# EAGLE design LED_board (EAGLE 9.6.2)
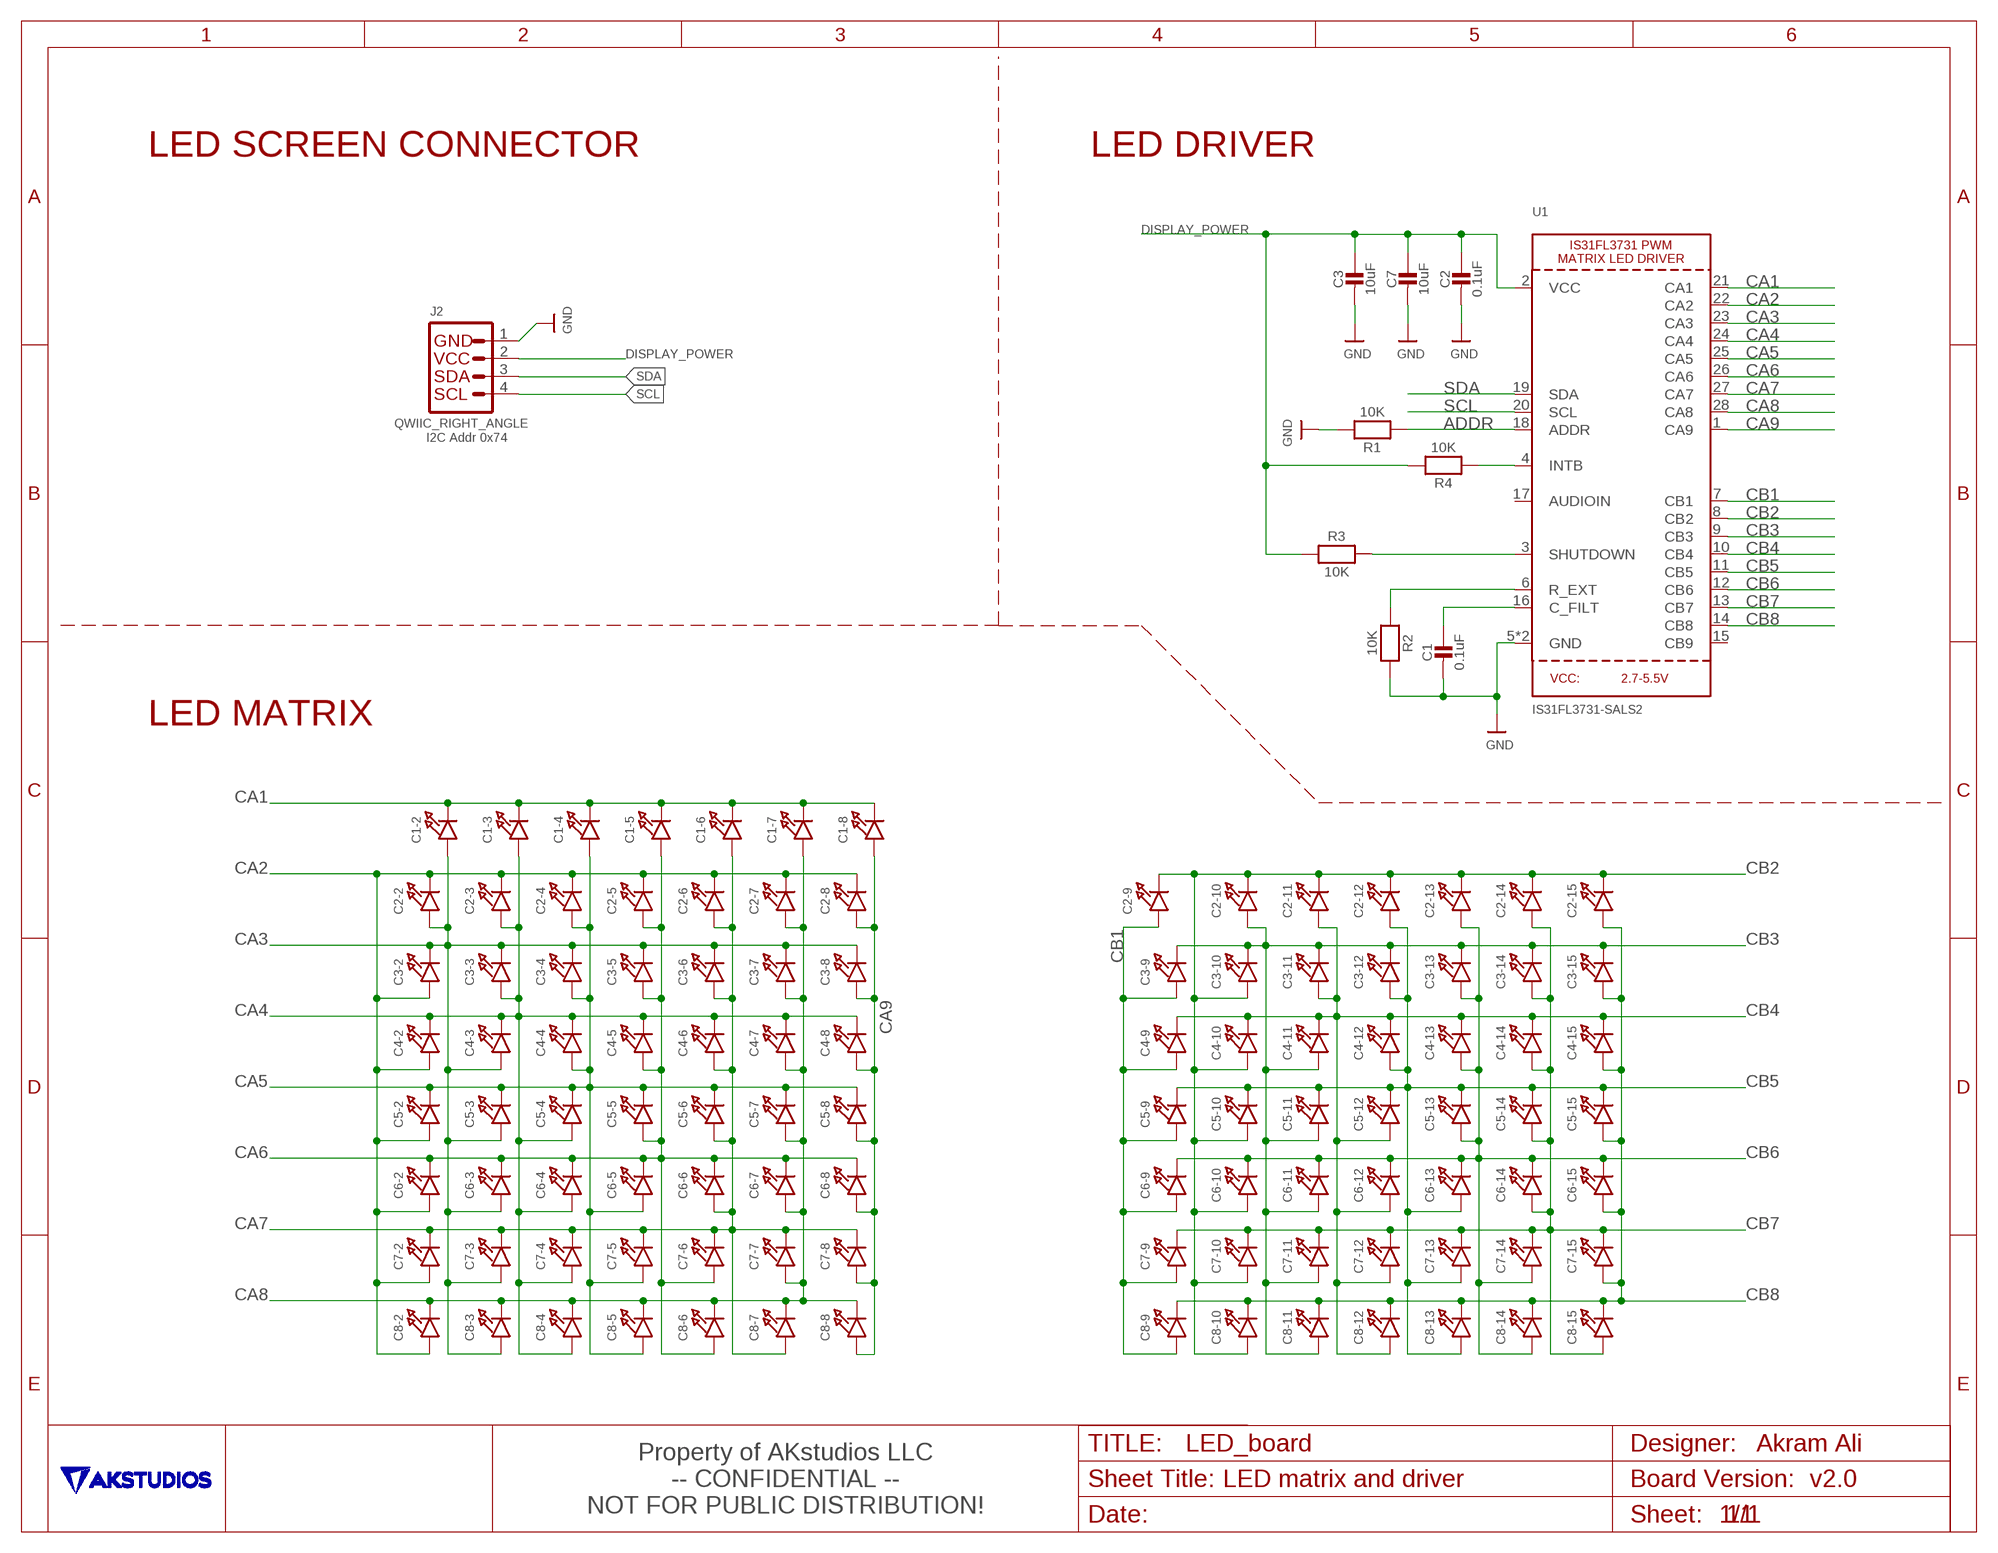
[diagram p0: schematic, sheet 1]

## Parts
C1  0.1uF  MICROBUILDER_CAP_CERAMIC_0402MP  [MICROBUILDER__0402MP]
C1-2  LED0603_NOOUTLINE  [CHIPLED_0603_NOOUTLINE]
C1-3  LED0603_NOOUTLINE  [CHIPLED_0603_NOOUTLINE]
C1-4  LED0603_NOOUTLINE  [CHIPLED_0603_NOOUTLINE]
C1-5  LED0603_NOOUTLINE  [CHIPLED_0603_NOOUTLINE]
C1-6  LED0603_NOOUTLINE  [CHIPLED_0603_NOOUTLINE]
C1-7  LED0603_NOOUTLINE  [CHIPLED_0603_NOOUTLINE]
C1-8  LED0603_NOOUTLINE  [CHIPLED_0603_NOOUTLINE]
C2  0.1uF  MICROBUILDER_CAP_CERAMIC_0402MP  [MICROBUILDER__0402MP]
C2-2  LED0603_NOOUTLINE  [CHIPLED_0603_NOOUTLINE]
C2-3  LED0603_NOOUTLINE  [CHIPLED_0603_NOOUTLINE]
C2-4  LED0603_NOOUTLINE  [CHIPLED_0603_NOOUTLINE]
C2-5  LED0603_NOOUTLINE  [CHIPLED_0603_NOOUTLINE]
C2-6  LED0603_NOOUTLINE  [CHIPLED_0603_NOOUTLINE]
C2-7  LED0603_NOOUTLINE  [CHIPLED_0603_NOOUTLINE]
C2-8  LED0603_NOOUTLINE  [CHIPLED_0603_NOOUTLINE]
C2-9  LED0603_NOOUTLINE  [CHIPLED_0603_NOOUTLINE]
C2-10  LED0603_NOOUTLINE  [CHIPLED_0603_NOOUTLINE]
C2-11  LED0603_NOOUTLINE  [CHIPLED_0603_NOOUTLINE]
C2-12  LED0603_NOOUTLINE  [CHIPLED_0603_NOOUTLINE]
C2-13  LED0603_NOOUTLINE  [CHIPLED_0603_NOOUTLINE]
C2-14  LED0603_NOOUTLINE  [CHIPLED_0603_NOOUTLINE]
C2-15  LED0603_NOOUTLINE  [CHIPLED_0603_NOOUTLINE]
C3  10uF  MICROBUILDER_CAP_CERAMIC_0402MP  [MICROBUILDER__0402MP]
C3-2  LED0603_NOOUTLINE  [CHIPLED_0603_NOOUTLINE]
C3-3  LED0603_NOOUTLINE  [CHIPLED_0603_NOOUTLINE]
C3-4  LED0603_NOOUTLINE  [CHIPLED_0603_NOOUTLINE]
C3-5  LED0603_NOOUTLINE  [CHIPLED_0603_NOOUTLINE]
C3-6  LED0603_NOOUTLINE  [CHIPLED_0603_NOOUTLINE]
C3-7  LED0603_NOOUTLINE  [CHIPLED_0603_NOOUTLINE]
C3-8  LED0603_NOOUTLINE  [CHIPLED_0603_NOOUTLINE]
C3-9  LED0603_NOOUTLINE  [CHIPLED_0603_NOOUTLINE]
C3-10  LED0603_NOOUTLINE  [CHIPLED_0603_NOOUTLINE]
C3-11  LED0603_NOOUTLINE  [CHIPLED_0603_NOOUTLINE]
C3-12  LED0603_NOOUTLINE  [CHIPLED_0603_NOOUTLINE]
C3-13  LED0603_NOOUTLINE  [CHIPLED_0603_NOOUTLINE]
C3-14  LED0603_NOOUTLINE  [CHIPLED_0603_NOOUTLINE]
C3-15  LED0603_NOOUTLINE  [CHIPLED_0603_NOOUTLINE]
C4-2  LED0603_NOOUTLINE  [CHIPLED_0603_NOOUTLINE]
C4-3  LED0603_NOOUTLINE  [CHIPLED_0603_NOOUTLINE]
C4-4  LED0603_NOOUTLINE  [CHIPLED_0603_NOOUTLINE]
C4-5  LED0603_NOOUTLINE  [CHIPLED_0603_NOOUTLINE]
C4-6  LED0603_NOOUTLINE  [CHIPLED_0603_NOOUTLINE]
C4-7  LED0603_NOOUTLINE  [CHIPLED_0603_NOOUTLINE]
C4-8  LED0603_NOOUTLINE  [CHIPLED_0603_NOOUTLINE]
C4-9  LED0603_NOOUTLINE  [CHIPLED_0603_NOOUTLINE]
C4-10  LED0603_NOOUTLINE  [CHIPLED_0603_NOOUTLINE]
C4-11  LED0603_NOOUTLINE  [CHIPLED_0603_NOOUTLINE]
C4-12  LED0603_NOOUTLINE  [CHIPLED_0603_NOOUTLINE]
C4-13  LED0603_NOOUTLINE  [CHIPLED_0603_NOOUTLINE]
C4-14  LED0603_NOOUTLINE  [CHIPLED_0603_NOOUTLINE]
C4-15  LED0603_NOOUTLINE  [CHIPLED_0603_NOOUTLINE]
C5-2  LED0603_NOOUTLINE  [CHIPLED_0603_NOOUTLINE]
C5-3  LED0603_NOOUTLINE  [CHIPLED_0603_NOOUTLINE]
C5-4  LED0603_NOOUTLINE  [CHIPLED_0603_NOOUTLINE]
C5-5  LED0603_NOOUTLINE  [CHIPLED_0603_NOOUTLINE]
C5-6  LED0603_NOOUTLINE  [CHIPLED_0603_NOOUTLINE]
C5-7  LED0603_NOOUTLINE  [CHIPLED_0603_NOOUTLINE]
C5-8  LED0603_NOOUTLINE  [CHIPLED_0603_NOOUTLINE]
C5-9  LED0603_NOOUTLINE  [CHIPLED_0603_NOOUTLINE]
C5-10  LED0603_NOOUTLINE  [CHIPLED_0603_NOOUTLINE]
C5-11  LED0603_NOOUTLINE  [CHIPLED_0603_NOOUTLINE]
C5-12  LED0603_NOOUTLINE  [CHIPLED_0603_NOOUTLINE]
C5-13  LED0603_NOOUTLINE  [CHIPLED_0603_NOOUTLINE]
C5-14  LED0603_NOOUTLINE  [CHIPLED_0603_NOOUTLINE]
C5-15  LED0603_NOOUTLINE  [CHIPLED_0603_NOOUTLINE]
C6-2  LED0603_NOOUTLINE  [CHIPLED_0603_NOOUTLINE]
C6-3  LED0603_NOOUTLINE  [CHIPLED_0603_NOOUTLINE]
C6-4  LED0603_NOOUTLINE  [CHIPLED_0603_NOOUTLINE]
C6-5  LED0603_NOOUTLINE  [CHIPLED_0603_NOOUTLINE]
C6-6  LED0603_NOOUTLINE  [CHIPLED_0603_NOOUTLINE]
C6-7  LED0603_NOOUTLINE  [CHIPLED_0603_NOOUTLINE]
C6-8  LED0603_NOOUTLINE  [CHIPLED_0603_NOOUTLINE]
C6-9  LED0603_NOOUTLINE  [CHIPLED_0603_NOOUTLINE]
C6-10  LED0603_NOOUTLINE  [CHIPLED_0603_NOOUTLINE]
C6-11  LED0603_NOOUTLINE  [CHIPLED_0603_NOOUTLINE]
C6-12  LED0603_NOOUTLINE  [CHIPLED_0603_NOOUTLINE]
C6-13  LED0603_NOOUTLINE  [CHIPLED_0603_NOOUTLINE]
C6-14  LED0603_NOOUTLINE  [CHIPLED_0603_NOOUTLINE]
C6-15  LED0603_NOOUTLINE  [CHIPLED_0603_NOOUTLINE]
C7  10uF  MICROBUILDER_CAP_CERAMIC_0402MP  [MICROBUILDER__0402MP]
C7-2  LED0603_NOOUTLINE  [CHIPLED_0603_NOOUTLINE]
C7-3  LED0603_NOOUTLINE  [CHIPLED_0603_NOOUTLINE]
C7-4  LED0603_NOOUTLINE  [CHIPLED_0603_NOOUTLINE]
C7-5  LED0603_NOOUTLINE  [CHIPLED_0603_NOOUTLINE]
C7-6  LED0603_NOOUTLINE  [CHIPLED_0603_NOOUTLINE]
C7-7  LED0603_NOOUTLINE  [CHIPLED_0603_NOOUTLINE]
C7-8  LED0603_NOOUTLINE  [CHIPLED_0603_NOOUTLINE]
C7-9  LED0603_NOOUTLINE  [CHIPLED_0603_NOOUTLINE]
C7-10  LED0603_NOOUTLINE  [CHIPLED_0603_NOOUTLINE]
C7-11  LED0603_NOOUTLINE  [CHIPLED_0603_NOOUTLINE]
C7-12  LED0603_NOOUTLINE  [CHIPLED_0603_NOOUTLINE]
C7-13  LED0603_NOOUTLINE  [CHIPLED_0603_NOOUTLINE]
C7-14  LED0603_NOOUTLINE  [CHIPLED_0603_NOOUTLINE]
C7-15  LED0603_NOOUTLINE  [CHIPLED_0603_NOOUTLINE]
C8-2  LED0603_NOOUTLINE  [CHIPLED_0603_NOOUTLINE]
C8-3  LED0603_NOOUTLINE  [CHIPLED_0603_NOOUTLINE]
C8-4  LED0603_NOOUTLINE  [CHIPLED_0603_NOOUTLINE]
C8-5  LED0603_NOOUTLINE  [CHIPLED_0603_NOOUTLINE]
C8-6  LED0603_NOOUTLINE  [CHIPLED_0603_NOOUTLINE]
C8-7  LED0603_NOOUTLINE  [CHIPLED_0603_NOOUTLINE]
C8-8  LED0603_NOOUTLINE  [CHIPLED_0603_NOOUTLINE]
C8-9  LED0603_NOOUTLINE  [CHIPLED_0603_NOOUTLINE]
C8-10  LED0603_NOOUTLINE  [CHIPLED_0603_NOOUTLINE]
C8-11  LED0603_NOOUTLINE  [CHIPLED_0603_NOOUTLINE]
C8-12  LED0603_NOOUTLINE  [CHIPLED_0603_NOOUTLINE]
C8-13  LED0603_NOOUTLINE  [CHIPLED_0603_NOOUTLINE]
C8-14  LED0603_NOOUTLINE  [CHIPLED_0603_NOOUTLINE]
C8-15  LED0603_NOOUTLINE  [CHIPLED_0603_NOOUTLINE]
J2  QWIIC_RIGHT_ANGLE  QWIIC_CONNECTORJS-1MM  [JST04_1MM_RA]
R1  10K  MICROBUILDER_RESISTOR_0402MP  [MICROBUILDER__0402MP]
R2  10K  MICROBUILDER_RESISTOR_0402MP  [MICROBUILDER__0402MP]
R3  10K  MICROBUILDER_RESISTOR_0402MP  [MICROBUILDER__0402MP]
R4  10K  MICROBUILDER_RESISTOR_0402MP  [MICROBUILDER__0402MP]
U1  IS31FL3731-SALS2  IS31FL3731QFN  [QFN28_4MM_0.4MM]

## Nets
ADDR: R1.1 U1.18(ADDR)
CA1: C1-2.C C1-3.C C1-4.C C1-5.C C1-6.C C1-7.C C1-8.C U1.21(CA1)
CA2: C2-2.C C2-3.C C2-4.C C2-5.C C2-6.C C2-7.C C2-8.C C3-2.A C4-2.A C5-2.A C6-2.A C7-2.A C8-2.A U1.22(CA2)
CA3: C1-2.A C2-2.A C3-2.C C3-3.C C3-4.C C3-5.C C3-6.C C3-7.C C3-8.C C4-3.A C5-3.A C6-3.A C7-3.A C8-3.A U1.23(CA3)
CA4: C1-3.A C2-3.A C3-3.A C4-2.C C4-3.C C4-4.C C4-5.C C4-6.C C4-7.C C4-8.C C5-4.A C6-4.A C7-4.A C8-4.A U1.24(CA4)
CA5: C1-4.A C2-4.A C3-4.A C4-4.A C5-2.C C5-3.C C5-4.C C5-5.C C5-6.C C5-7.C C5-8.C C6-5.A C7-5.A C8-5.A U1.25(CA5)
CA6: C1-5.A C2-5.A C3-5.A C4-5.A C5-5.A C6-2.C C6-3.C C6-4.C C6-5.C C6-6.C C6-7.C C6-8.C C7-6.A C8-6.A U1.26(CA6)
CA7: C1-6.A C2-6.A C3-6.A C4-6.A C5-6.A C6-6.A C7-2.C C7-3.C C7-4.C C7-5.C C7-6.C C7-7.C C7-8.C C8-7.A U1.27(CA7)
CA8: C1-7.A C2-7.A C3-7.A C4-7.A C5-7.A C6-7.A C7-7.A C8-2.C C8-3.C C8-4.C C8-5.C C8-6.C C8-7.C C8-8.C U1.28(CA8)
CA9: C1-8.A C2-8.A C3-8.A C4-8.A C5-8.A C6-8.A C7-8.A C8-8.A U1.1(CA9)
CB1: C2-9.A C3-9.A C4-9.A C5-9.A C6-9.A C7-9.A C8-9.A U1.7(CB1)
CB2: C2-9.C C2-10.C C2-11.C C2-12.C C2-13.C C2-14.C C2-15.C C3-10.A C4-10.A C5-10.A C6-10.A C7-10.A C8-10.A U1.8(CB2)
CB3: C2-10.A C3-9.C C3-10.C C3-11.C C3-12.C C3-13.C C3-14.C C3-15.C C4-11.A C5-11.A C6-11.A C7-11.A C8-11.A U1.9(CB3)
CB4: C2-11.A C3-11.A C4-9.C C4-10.C C4-11.C C4-12.C C4-13.C C4-14.C C4-15.C C5-12.A C6-12.A C7-12.A C8-12.A U1.10(CB4)
CB5: C2-12.A C3-12.A C4-12.A C5-9.C C5-10.C C5-11.C C5-12.C C5-13.C C5-14.C C5-15.C C6-13.A C7-13.A C8-13.A U1.11(CB5)
CB6: C2-13.A C3-13.A C4-13.A C5-13.A C6-9.C C6-10.C C6-11.C C6-12.C C6-13.C C6-14.C C6-15.C C7-14.A C8-14.A U1.12(CB6)
CB7: C2-14.A C3-14.A C4-14.A C5-14.A C6-14.A C7-9.C C7-10.C C7-11.C C7-12.C C7-13.C C7-14.C C7-15.C C8-15.A U1.13(CB7)
CB8: C2-15.A C3-15.A C4-15.A C5-15.A C6-15.A C7-15.A C8-9.C C8-10.C C8-11.C C8-12.C C8-13.C C8-14.C C8-15.C U1.14(CB8)
DISPLAY_POWER: C2.1 C3.1 C7.1 J2.2 R3.1 R4.2 U1.2(VCC)
GND: C1.2 C2.2 C3.2 C7.2 J2.1 R1.2 R2.2 U1.5(GND) U1.THERMAL(GND)
N$1: R3.2 U1.3(SHUTDOWN)
N$2: C1.1 U1.16(C_FILT)
N$3: R4.1 U1.4(INTB)
R_EXT: R2.1 U1.6(R_EXT)
SCL: J2.4 U1.20(SCL)
SDA: J2.3 U1.19(SDA)
Unconnected: U1.15(CB9) U1.17(AUDIOIN)

## Notes on the sheet
- LED SCREEN CONNECTOR | LED DRIVER
- I2C Addr 0x74
- LED MATRIX
- Akram Ali
- Property of AKstudios LLC
- v2.0
- -- CONFIDENTIAL --
  NOT FOR PUBLIC DISTRIBUTION!

## Library data of the parts
C1-C3 C7 = Adafruit Feather 32u4 Bluefruit LE:MICROBUILDER_CAP_CERAMIC: Ceramic Capacitors For new designs, use the packages preceded by an '_' character since they are more reliable: The following footprints should be used on most boards: _0402 - Standard footprint for regular board layouts _0603 - Standard footprint for regular board layouts _0805 - Standard footprint for regular board layouts _1206 - Standard footprint for regular board layouts For extremely tight-pitch boards where space is at a premium, the following 'micro-pitch' footprints can be used (smaller pads, no silkscreen outline, etc.): _0402MP - Micro-pitch footprint for very dense/compact boards _0603MP - Micro-pitch footprint for very dense/compact boards _0805MP - Micro-pitch footprint for very dense/compact boards _1206MP - Micro-pitch footprint for very dense/compact boards; MPN: GRM155R71C104KA88J
C1-2-C1-8 C2-2-C2-15 C3-2-C3-15 C4-2-C4-15 C5-2-C5-15 C6-2-C6-15 C7-2-C7-15 C8-2-C8-15 = microbuilder:LED: LED 0603 - 0603 Surface Mount Package 2mA: Green LED - Low Power (3.9mcd, 2ma, 1.7Vf) - Digikey: 475-2709-2-ND Orange LED - Low Power (9.8mcd, 2ma, 1.8Vf) - Digikey: 475-1194-2-ND Red LED - Low Power (5mcd, 2ma, 1.8Vf) - Digikey: 475-1195-2-ND Yellow LED - Low Power (7mcd, 2ma, 1.8Vf) - Digikey: 475-1196-2-ND 5mA: Blue LED - Low Power (17mcd, 5ma, 2.9Vf) - Digikey: LNJ937W8CRACT-ND 0805 - 0805 Surface Mount Package 2mA: Red LED (8.8mcd, 2mA, 1.8Vf, Clear) - Low Power [Digikey: 475-2510-1-ND] Green LED (5mcd, 2mA, 1.8Vf, Clear) - Low Power [Digikey: 475-2730-1-ND] Yellow LED (11.3mcd, 2mA, 1.8Vf, Clear) - Low Power [Digikey: 475-2555-1-ND] 20mA: Red LED (104mcd, 20mA, Diffused) - LS R976 [Digikey: 475-1278-6-ND] Red LED (12mcd, 20mA, 2.0Vf, Clear) - APT2012EC [Digikey: 754-1128-1-ND] Green LED (15mcd, 20mA, 2.2Vf, Clear) - APT2012GC [Digikey: 754-1131-1-ND] Orange LED (160mcd, 20mA, 2.1Vf, Clear) - APT2012SECK [Digikey: 754-1130-1-ND] 1206 - 1206 Surface Mount Package Green LED (26mcd, 20mA, Diffused) - LG N971 [Digikey: 475-1407-6-ND] Red LED (15mcd, 20mA, Diffused) - LH N974 [Digikey: 475-1416-6-ND] Cree - Cree High-Power Surface Mount LEDs XPEBWT-L1-0000-00D50 - White 111lm 350mA 2.9Vf 6200K 110° XTEAWT-00-0000-00000LEE3 - White 114lm 350mA 2.85Vf 5000K 115° Everlight - Everlight 45-21 Series Surface Mount LEDs 45-21/QK2C-B2832AC2CB2/2T - Warm White 2000mcd 20mA 3.25Vf 3050K 120° 45-21/LK2C-B38452C4CB2/2T - Nuetral White 2000mcd 20mA 3.25Vf 4150K 120° 45-21/LK2C-B50634C6CB2/2T - Cold White 2200mcd 20mA 3.25Vf 5650K 120° PLCC2 Reverse Mount LS T77K-J1L2-1-0-2-R18-Z - Red 11.25mcd 2mA 1.8Vf 630nm 120° LO T77K-L1M2-24-Z - Orange 19.6mcd 2mA 1.8Vf 606nm 120° LY T77K-K2M1-26-Z - Yellow 15.7mcd 2mA 1.8Vf 587nm 120°
J2 = SparkFun-Connectors:QWIIC_CONNECTOR: SparkFun I2C Standard Qwiic Connector An SMD 1mm pitch JST connector makes it easy and quick (get it? Qwiic?) to connect I2C devices to each other. The Qwiic system <http://www.sparkfun.com/qwiic> enables fast and solderless connection between popular platforms and various sensors and actuators. We carry 200mm <https://www.sparkfun.com/products/14204>, 100mm <https://www.sparkfun.com/products/14205>, 50mm <https://www.sparkfun.com/products/14206>, and breadboard friendly <https://www.sparkfun.com/products/14207> Qwiic cables. We also offer 10 pcs strips <https://www.sparkfun.com/products/14323> the SMD connectors.; MPN: SM04B-SRSS-TB(LF)(SN); PROD_ID: CONN-13694
R1-R4 = Adafruit Feather 32u4 Bluefruit LE:MICROBUILDER_RESISTOR: Resistors For new designs, use the packages preceded by an '_' character since they are more reliable: The following footprints should be used on most boards: _0402 - Standard footprint for regular board layouts _0603 - Standard footprint for regular board layouts _0805 - Standard footprint for regular board layouts _1206 - Standard footprint for regular board layouts For extremely tight-pitch boards where space is at a premium, the following 'micro-pitch' footprints can be used (smaller pads, no silkscreen outline, etc.): _0402MP - Micro-pitch footprint for very dense/compact boards _0603MP - Micro-pitch footprint for very dense/compact boards _0805MP - Micro-pitch footprint for very dense/compact boards _1206MP - Micro-pitch footprint for very dense/compact boards; MPN: RC0402FR-7W10KL
U1 = microbuilder:IS31FL3731: IS31FL3731 PWM LED Matrix Driver

## Net classes
1 power: width 0.127 mm, clearance 0.127 mm

## Board
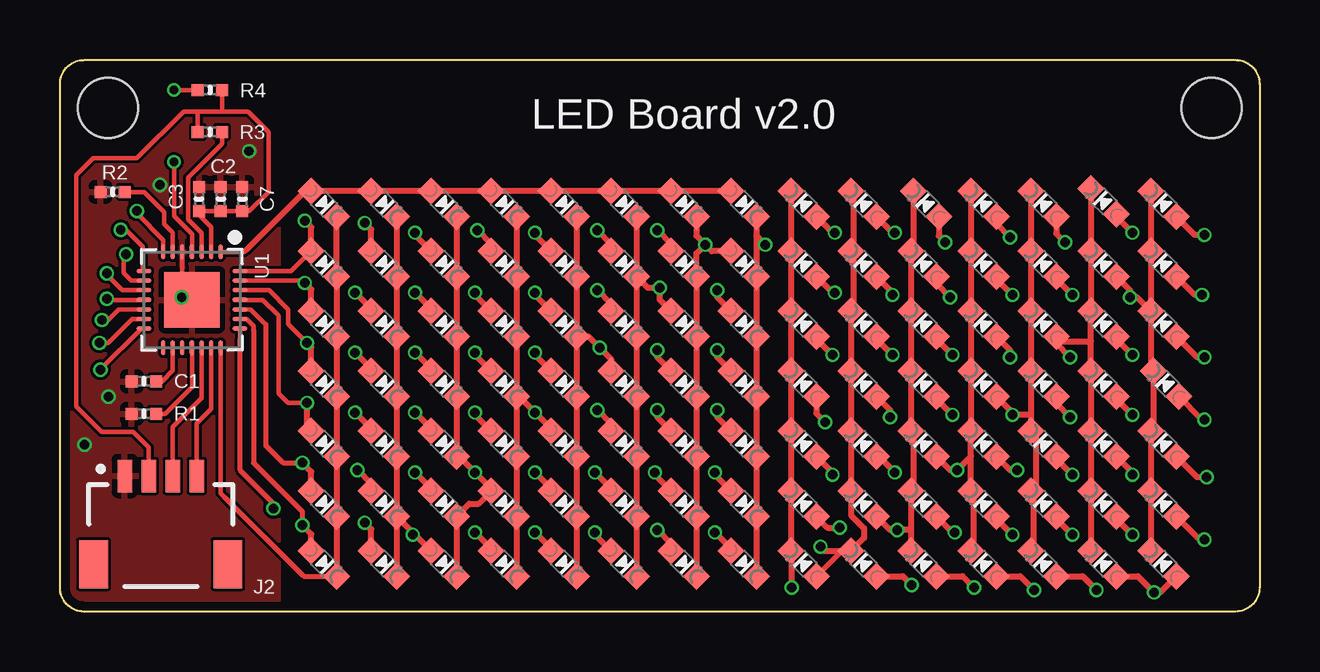
[diagram p1: board, top side]
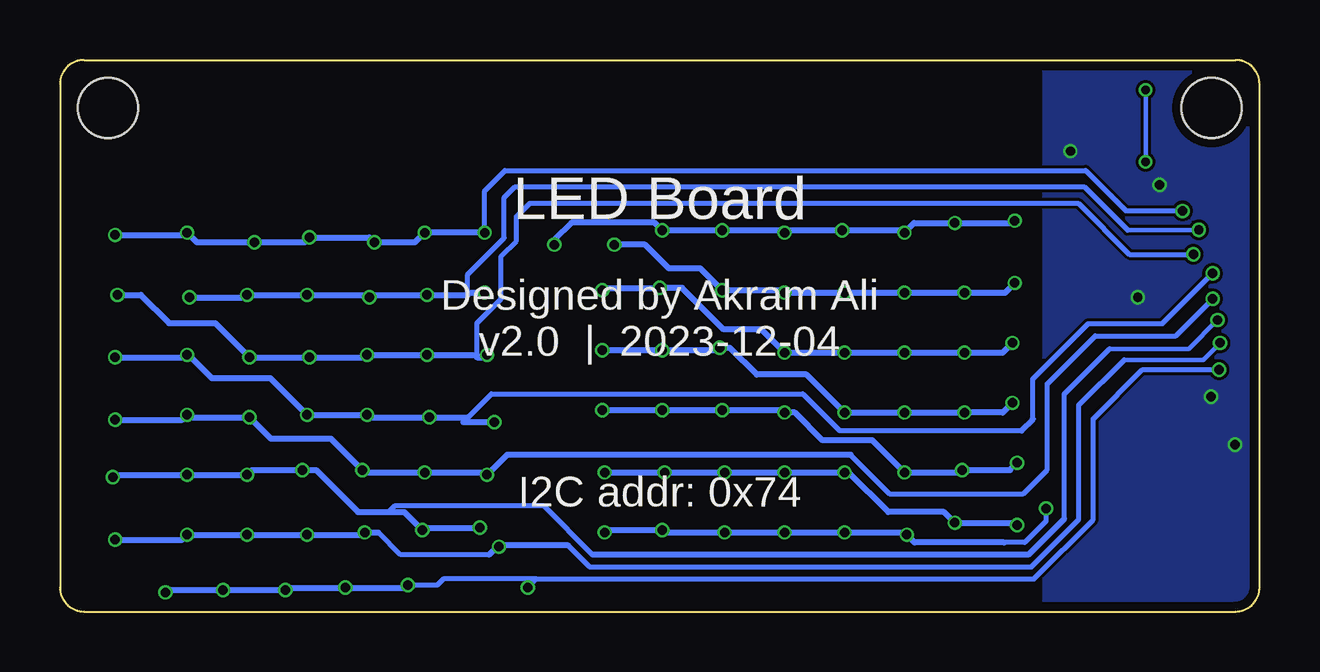
[diagram p2: board, bottom side, seen from below]

Size 50 x 23 mm. Coordinates in mm from the lower left corner, seen from the top.
Outline: 49,0 1,0 arc-90 0,1 0,22 arc-90 1,23 49,23 arc-90 50,22 50,1 arc-90 49,0
Copper layers (1*2*15*16): Top 0.035559375mm / dielectric 0.17018125mm / Route2 0.01778125mm / dielectric 47mil / Route15 0.01778125mm / dielectric 0.17018125mm / Bottom 0.035559375mm
Design rules "oshpark-4layer *": minimum track width 5mil, minimum drill 10mil, track to track 5mil, track to pad 5mil, pad to pad 5mil, via to via 5mil, smd to smd 5mil, copper to edge 15mil, drill to drill 6mil, minimum pad ring 4mil, minimum via ring 4mil, stop-mask expansion 1.5mil, vias tented up to drill 10mil, thermal gap 10mil
Holes 2.5 mm at 2,21 48,21

### Footprints (pad centres in the part's own frame; a part is rotated, then mirrored left to right if it is on the bottom)
MICROBUILDER__0402MP = smd 0.5 x 0.5: 1 -0.508,0; 2 0.508,0
CHIPLED_0603_NOOUTLINE = smd 0.8 x 0.8: A 0,-0.75; C 0,0.75
JST04_1MM_RA = smd 0.6 x 1.35: 1 -1.5,0; 2 -0.5,0; 3 0.5,0; 4 1.5,0 | smd 1.2 x 2: NC1 2.8,-3.675; NC2 -2.8,-3.675
QFN28_4MM_0.4MM = smd 0.6 x 0.18: 1 -2,1.2; 2 -2,0.8; 3 -2,0.4; 4 -2,0; 5 -2,-0.4; 6 -2,-0.8; 7 -2,-1.2; 15 2,-1.2; 16 2,-0.8; 17 2,-0.4; 18 2,0; 19 2,0.4; 20 2,0.8; 21 2,1.2 | smd 0.18 x 0.6: 8 -1.2,-2; 9 -0.8,-2; 10 -0.4,-2; 11 0,-2; 12 0.4,-2; 13 0.8,-2; 14 1.2,-2; 22 1.2,2; 23 0.8,2; 24 0.4,2; 25 0,2; 26 -0.4,2; 27 -0.8,2; 28 -1.2,2 | smd 2.3 x 2.3: THERMAL 0,0

### Placement (x,y rotation side)
C1  3.5,9.6 180 top
C1-2  11,2 225 top
C1-3  11,4.5 225 top
C1-4  11,7 225 top
C1-5  11,9.5 225 top
C1-6  11,12 225 top
C1-7  11,14.5 225 top
C1-8  11,17 225 top
C2  6.7,17.2 90 top
C2-2  13.5,2 225 top
C2-3  13.5,4.5 225 top
C2-4  13.5,7 225 top
C2-5  13.5,9.5 225 top
C2-6  13.5,12 225 top
C2-7  13.5,14.5 225 top
C2-8  13.5,17 225 top
C2-9  46,17 45 top
C2-10  46,14.5 45 top
C2-11  46,12 45 top
C2-12  46.1,9.5 45 top
C2-13  46,7 45 top
C2-14  46,4.5 45 top
C2-15  46,2 45 top
C3  5.8,17.2 90 top
C3-2  16,2 225 top
C3-3  16,4.5 225 top
C3-4  16,7 225 top
C3-5  16,9.5 225 top
C3-6  16,12 225 top
C3-7  16,14.5 225 top
C3-8  16,17 225 top
C3-9  43.5,17.1 45 top
C3-10  43.5,14.5 45 top
C3-11  43.5,12 45 top
C3-12  43.5,9.5 45 top
C3-13  43.5,7 45 top
C3-14  43.5,4.5 45 top
C3-15  43.5,2 45 top
C4-2  18.5,2 225 top
C4-3  18.5,4.5 225 top
C4-4  18.5,7 225 top
C4-5  18.5,9.5 225 top
C4-6  18.5,12 225 top
C4-7  18.5,14.5 225 top
C4-8  18.5,17 225 top
C4-9  41,17 45 top
C4-10  41,14.5 45 top
C4-11  41,12 45 top
C4-12  41,9.5 45 top
C4-13  41,7 45 top
C4-14  41,4.5 45 top
C4-15  41,2 45 top
C5-2  21,2 225 top
C5-3  21,4.5 225 top
C5-4  21,7 225 top
C5-5  21,9.5 225 top
C5-6  21,12 225 top
C5-7  21,14.5 225 top
C5-8  21,17 225 top
C5-9  38.5,17 45 top
C5-10  38.5,14.5 45 top
C5-11  38.5,12 45 top
C5-12  38.5,9.5 45 top
C5-13  38.5,7 45 top
C5-14  38.5,4.5 45 top
C5-15  38.5,2 45 top
C6-2  23.5,2 225 top
C6-3  23.5,4.5 225 top
C6-4  23.5,7 225 top
C6-5  23.5,9.5 225 top
C6-6  23.5,12 225 top
C6-7  23.5,14.5 225 top
C6-8  23.5,17 225 top
C6-9  36.1,17 45 top
C6-10  36,14.5 45 top
C6-11  36,12 45 top
C6-12  36,9.5 45 top
C6-13  36,7 45 top
C6-14  36,4.5 45 top
C6-15  36,2 45 top
C7  7.6,17.2 90 top
C7-2  26,2 225 top
C7-3  26,4.5 225 top
C7-4  26,7 225 top
C7-5  26,9.5 225 top
C7-6  26,12 225 top
C7-7  26,14.5 225 top
C7-8  26,17 225 top
C7-9  33.5,17 45 top
C7-10  33.5,14.5 45 top
C7-11  33.5,12 45 top
C7-12  33.5,9.5 45 top
C7-13  33.5,7 45 top
C7-14  33.5,4.5 45 top
C7-15  33.5,2 45 top
C8-2  28.5,2 225 top
C8-3  28.5,4.5 225 top
C8-4  28.5,7 225 top
C8-5  28.5,9.5 225 top
C8-6  28.5,12 225 top
C8-7  28.5,14.5 225 top
C8-8  28.5,17 225 top
C8-9  31,17 45 top
C8-10  31,14.5 45 top
C8-11  31,12 45 top
C8-12  31,9.5 45 top
C8-13  31,7 45 top
C8-14  31,4.5 45 top
C8-15  31,2 45 top
J2  4.2,5.65 0 top
R1  3.5,8.25 180 top
R2  2.2,17.5 180 top
R3  6.25,20 0 top
R4  6.25,21.75 0 top
U1  5.5,13 270 top

### Tracks (layer width: path | path; a pad name or v marks a point on that pad's centre or on a via)
ADDR
  Top 0.178: R1.1 4.38,8.25 5.5,9.37 U1.18
CA1
  Top 0.178: U1.21 6.7,4.93 6.86,4.76
  Top 0.203: 6.86,4.76 10.16,1.47 C1-2.C
  Top 0.254: C1-2.C C1-3.C C1-4.C C1-5.C C1-6.C C1-7.C C1-8.C
CA2  (via drill 0.39)
  Top 0.178: 7.51,11.36 7.51,11.79 U1.22
  Top 0.203: 7.51,11.36 7.51,5.89 8.9,4.5 v8.9,4.3
  Top 0.254: C2-3.C C2-4.C C2-5.C C2-6.C C2-7.C C2-8.C | C4-2.A 17.97,2.63 v17.3,3.3 | C5-2.A 20.47,2.63 v19.8,3.3 | C7-2.A 25.47,2.83 v24.9,3.4 | C8-2.A 27.97,2.63 v27.3,3.3 | C2-3.C C2-2.C | C6-2.A 22.3,3.2 v22.3,3.3 | C3-2.A 14.8,3.2 v14.7,3.2 14.7,3.3 C2-3.C
  Bottom 0.203: 10.65,2.88 9.79,2.88 8.9,3.77 v8.9,4.3
  Bottom 0.254: v27.3,3.3 27.2,3.4 v24.9,3.4 24.8,3.3 v22.3,3.3 v19.8,3.3 v17.3,3.3 14.8,3.3 v14.7,3.2 14.38,2.88 10.65,2.88
CA3  (via drill 0.39)
  Top 0.178: 8.07,11.73 8.07,11.91 7.78,12.2 U1.23
  Top 0.203: 8.07,11.73 8.07,6.2 10.1,4.17 v10.1,3.6
  Top 0.254: C3-2.C C3-3.C 17.06,4.5 17.44,4.5 C4-3.A 17.97,5.13 v17.3,5.8 16.63,6.47 C3-4.C C3-5.C C3-6.C C3-7.C C3-8.C | C8-3.A 27.3,5.7 v27.3,5.8 | C7-3.A 24.8,5.7 v24.8,5.8 | C6-3.A 22.97,5.13 v22.3,5.8 | C5-3.A 20.47,5.13 v19.8,5.8 | C2-2.A 12.97,3.43 v12.7,3.7 | C1-2.A 10.47,3.23 v10.1,3.6
  Bottom 0.254: v10.1,3.6 10.2,3.7 v12.7,3.7 13.15,4.15 15.48,4.15 17.13,5.8 v17.3,5.8 v19.8,5.8 v22.3,5.8 v24.8,5.8 v27.3,5.8
CA4  (via drill 0.39)
  Top 0.178: U1.24 7.95,12.6 8.58,11.97
  Top 0.203: 8.58,11.97 8.58,6.92 9.3,6.2 v10.1,6.2
  Top 0.254: C4-2.C C4-3.C C4-4.C C4-5.C | C4-5.C C4-6.C C4-7.C C4-8.C | C8-4.A 27.4,8.1 v27.4,8.4 | C7-4.A 24.9,8.1 v24.9,8.4 | C6-4.A 22.97,7.83 v22.4,8.4 | C5-4.A 20.47,7.63 v19.8,8.3 19.13,8.97 C4-5.C | C2-3.A 12.97,5.33 v12.4,5.9 | C3-3.A 15.47,5.13 v14.8,5.8 | C1-3.A 10.47,5.83 v10.1,6.2
  Bottom 0.254: v27.4,8.4 v24.9,8.4 v22.4,8.4 19.9,8.4 v19.8,8.3 19.37,8.3 18.22,7.14 16.14,7.14 v14.8,5.8 12.5,5.8 v12.4,5.9 10.4,5.9 v10.1,6.2
CA5  (via drill 0.39)
  Top 0.178: v10.3,8.7 9.5,8.7 9.11,9.09 9.11,12.34 8.45,13 U1.25
  Top 0.254: C5-8.C C5-7.C C5-6.C | C5-6.C C5-5.C C5-4.C C5-3.C C5-2.C | C4-4.A 17.3,8.2 v17.3,8.3 | C3-4.A 15.47,7.63 v14.8,8.3 | C8-5.A 27.4,10.6 v27.4,10.9 | C7-5.A 24.9,10.6 v24.9,10.9 | C6-5.A 22.97,10.53 v22.5,11 22.03,11.47 C5-6.C | C1-4.A 10.3,7.7 v10.3,8.7 | v12.3,8.3 12.97,7.63 C2-4.A
  Bottom 0.254: v27.4,10.9 v24.9,10.9 22.6,10.9 v22.5,11 22.07,11 20.96,9.88 18.88,9.88 v17.3,8.3 v14.8,8.3 v12.3,8.3 10.7,8.3 v10.3,8.7
CA6  (via drill 0.39)
  Top 0.178: v10.3,11.2 9.51,11.99 9.51,12.6 8.71,13.4 U1.26
  Top 0.254: C6-8.C C6-7.C | C6-2.C C6-3.C C6-4.C C6-5.C C6-6.C C6-7.C | C5-5.A 19.8,10.7 v19.8,10.8 | C4-5.A 17.3,10.7 v17.3,10.8 | C3-5.A 15.47,10.13 v14.8,10.8 | C2-5.A 12.97,10.13 v12.3,10.8 | C7-6.A 25,13 v25,13.5 24.5,13.5 C6-7.C | C8-6.A 27.4,13.1 v27.4,13.4 | C1-5.A 10.47,11.03 v10.3,11.2
  Bottom 0.254: v27.4,13.4 27.3,13.5 v25,13.5 24.07,13.5 22.34,11.77 20.77,11.77 v19.8,10.8 v17.3,10.8 v14.8,10.8 v12.3,10.8 10.7,10.8 v10.3,11.2
CA7  (via drill 0.39)
  Top 0.178: U1.27 10.2,13.8 10.37,13.63
  Top 0.254: C7-2.C C7-3.C C7-4.C C7-5.C C7-6.C C7-7.C 26.53,14.93 v26.9,15.3 | C2-6.A 12.97,12.63 v12.3,13.3 | C3-6.A 15.47,12.63 v14.8,13.3 | C4-6.A 17.3,13.2 v17.3,13.3 | C5-6.A 19.8,13.2 v19.8,13.3 | C6-6.A 22.97,12.83 v22.4,13.4 | C7-8.C 26.53,15.67 v26.9,15.3 | C8-7.A 27.17,15.03 v26.9,15.3 | C1-6.A 10.47,13.43 10.37,13.53 | 10.37,13.53 10.37,13.63 | 10.37,13.53 v10.2,13.7
  Bottom 0.254: v26.9,15.3 25.61,15.3 24.62,14.31 23.31,14.31 v22.4,13.4 19.9,13.4 v19.8,13.3 v17.3,13.3 v14.8,13.3 v12.3,13.3 10.6,13.3 v10.2,13.7
CA8  (via drill 0.39)
  Top 0.178: U1.28 9.64,14.2 C1-7.A
  Top 0.254: C8-2.C C8-3.C C8-4.C C8-5.C C8-6.C C8-7.C C8-8.C 29.03,15.67 v29.4,15.3 | C7-7.A 25.47,15.33 v24.9,15.9 | v19.8,15.8 19.8,15.7 C5-7.A | C4-7.A 17.97,15.33 v17.4,15.9 | C3-7.A 14.8,15.7 v14.8,15.8 | C2-7.A 12.97,15.93 v12.7,16.2 | C1-7.A 10.47,16.03 v10.2,16.3 | v22.4,15.9 22.97,15.33 C6-7.A
  Bottom 0.254: v29.4,15.3 29.4,15.5 28.69,16.21 25.21,16.21 v24.9,15.9 v22.4,15.9 19.9,15.9 v19.8,15.8 19.7,15.9 v17.4,15.9 14.9,15.9 v14.8,15.8 14.4,16.2 v12.7,16.2 10.3,16.2 v10.2,16.3
CA9
  Top 0.178: 7.79,15.11 7.69,15 U1.1
  Top 0.254: C8-8.A C7-8.A C6-8.A C5-8.A C4-8.A C3-8.A C2-8.A C1-8.A 10.22,17.53 7.79,15.11
CB1  (via drill 0.39)
  Top 0.178: U1.7 4.3,15.5 3.21,16.59 v3.21,16.7
  Top 0.254: v44.7,15.8 44.03,16.47 C3-9.A | v41.9,15.4 41.53,15.77 C4-9.A | v39.6,15.6 39.03,16.17 C5-9.A | C6-9.A 36.63,15.67 v36.9,15.4 | v34.8,15.8 34.7,15.8 C7-9.A | v32.3,15.8 32.2,15.8 C8-9.A | v47.7,15.7 47.3,15.7 C2-9.A
  Bottom 0.203: v3.21,16.7 5.56,16.7 7.25,18.39 31.45,18.39 32.3,17.54 v32.3,15.8
  Bottom 0.254: v47.7,15.7 44.8,15.7 v44.7,15.8 44.3,15.4 v41.9,15.4 39.8,15.4 v39.6,15.6 37.1,15.6 v36.9,15.4 35.2,15.4 v34.8,15.8 v32.3,15.8
CB2  (via drill 0.39)
  Top 0.178: v2.53,15.91 2.76,15.91 3.45,15.22 3.45,14.25 U1.8
  Top 0.254: C2-11.C 45.47,10.13 C2-12.C 45.57,7.63 C2-13.C C2-14.C C2-15.C | C2-9.C C2-10.C C2-11.C | v34.7,13.2 34.7,13.3 C7-10.A | v37.1,13.1 36.53,13.67 C6-10.A | v39.7,13.2 39.03,13.87 C5-10.A | C4-10.A 41.53,13.87 v42.2,13.2 | C2-11.C 44.9,13.1 v44.6,13.1 44.6,13.4 C3-10.A | v32.3,13.3 32.2,13.3 C8-10.A
  Bottom 0.178: 5.5,15.9 v2.54,15.9 v2.53,15.91
  Bottom 0.203: 33,13.2 33,13.3 33,14.06 31.48,15.58 31.48,17.26 31.03,17.72 7.31,17.72 5.5,15.9
  Bottom 0.254: 33,13.2 v34.7,13.2 37,13.2 v37.1,13.1 37.2,13.2 v39.7,13.2 v42.2,13.2 42.3,13.1 v44.6,13.1 | 33,13.3 v32.3,13.3
CB3  (via drill 0.39)
  Top 0.178: v2.76,14.89 2.65,14.78 2.65,14.12 2.97,13.8 U1.9
  Top 0.254: C3-15.C C3-14.C C3-13.C C3-12.C 42.97,11.26 | 42.97,11.26 C3-11.C C3-10.C C3-9.C | 42.97,11.26 41.74,11.26 C4-11.A 41.53,11.17 v42.1,10.6 | v32.2,10.7 31.53,11.37 C8-11.A | C7-11.A 34.03,11.37 v34.7,10.7 | v37.2,10.7 36.53,11.37 C6-11.A | v39.6,10.6 39.6,10.9 C5-11.A | v47.6,13.2 47.3,13.2 C2-10.A
  Bottom 0.203: 32.62,10.6 32.62,10.7 32.62,12.02 31.61,13.04 31.61,14.82 30.97,15.45 30.97,16.47 30.41,17.03 7.55,17.03 5.42,14.89 v2.76,14.89
  Bottom 0.254: 32.62,10.7 v34.7,10.7 v37.2,10.7 37.3,10.6 v39.6,10.6 v42.1,10.6 43.52,12.02 45.45,12.02 46.63,13.2 v47.6,13.2 | 32.62,10.6 32.3,10.6 v32.2,10.7
CB4  (via drill 0.39)
  Top 0.178: v1.95,14.11 1.95,14.05 2.6,13.4 U1.10
  Top 0.254: C4-13.C C4-12.C C4-11.C C4-10.C C4-9.C | C4-13.C 40.47,8.2 v39.7,8.2 39.7,8.3 C5-12.A | C4-13.C 40.67,7.33 40.67,5.23 C4-14.C 40.57,4.93 40.57,2.63 C4-15.C | v44.7,10.7 44.03,11.37 C3-11.A | v31.9,7.9 31.53,8.27 C8-12.A | v34.6,8.1 34.6,8.4 C7-12.A | v37.2,8.2 36.53,8.87 C6-12.A | v47.7,10.6 47.4,10.6 C2-11.A
  Bottom 0.203: 33.19,7.9 32.99,8.1 32.02,9.08 19.03,9.08 17.51,7.55 9.92,7.55 | 9.46,8.05 9.46,9.69 7.14,12.01 4.05,12.01 v1.95,14.11
  Bottom 0.254: v47.7,10.6 44.8,10.6 v44.7,10.7 44.63,10.7 43.67,9.74 41.24,9.74 v39.7,8.2 v37.2,8.2 37.1,8.1 v34.6,8.1 32.99,8.1 | 33.19,7.9 v31.9,7.9 | 9.46,8.05 9.46,8.01 9.92,7.55
CB5  (via drill 0.39)
  Top 0.178: U1.11 1.99,13 v1.95,13.04
  Top 0.254: C4-12.A 41.53,8.67 v42.1,8.1 | C3-12.A 44.03,8.87 v44.7,8.2 | C5-15.C 38.07,2.63 38.07,4.93 C5-14.C 37.97,6.47 | 37.97,6.47 C5-13.C C5-12.C C5-11.C C5-10.C C5-9.C | 37.97,6.47 v37.4,5.9 37.1,5.9 C6-13.A | v32.2,5.7 32.2,5.8 C8-13.A | v47.7,8 47.6,8 C2-12.A | C7-13.A 34.13,6.47 v34.8,5.8
  Bottom 0.203: 17.05,6.54 15.42,4.91 9.84,4.91 8.85,5.91 8.85,9.5 6.85,11.5 3.49,11.5 v1.95,13.04
  Bottom 0.254: v47.7,8 44.9,8 v44.7,8.2 44.6,8.1 v42.1,8.1 41.2,7.2 38.7,7.2 v37.4,5.9 37.3,5.8 v34.8,5.8 32.3,5.8 v32.2,5.7 31.36,6.54 17.05,6.54
CB6  (via drill 0.39)
  Top 0.178: v1.75,12.15 2,12.15 2.45,12.6 U1.12
  Top 0.254: v47.8,5.6 47.4,5.6 C2-13.A | v44.7,5.7 44.7,5.8 C3-13.A | v42.2,5.7 41.53,6.37 C4-13.A | C6-9.C 35.57,15.13 C6-10.C C6-11.C C6-12.C C6-13.C 35.57,7.43 35.57,5.13 C6-14.C 35.47,3.4 | 35.47,3.4 C6-15.C | C7-14.A 34.6,3.4 v34.9,3.4 35.47,3.4 | v39.9,5.9 39.6,5.9 C5-13.A | C8-14.A 32,3.5 v32.5,3.5
  Bottom 0.178: v1.75,12.15 2.95,10.95 6.26,10.95
  Bottom 0.203: 8.14,3.87 8.14,9.07 6.26,10.95 | 27.8,2.37 29.83,4.4 36.05,4.4 36.31,4.15
  Bottom 0.254: v47.8,5.6 47.7,5.7 v44.7,5.7 v42.2,5.7 42,5.9 v39.9,5.9 39.33,5.9 37.58,4.15 36.31,4.15 35.65,4.15 v34.9,3.4 34.8,3.5 v32.5,3.5 | 8.14,3.87 9.64,2.37 27.8,2.37
CB7  (via drill 0.39)
  Top 0.178: v1.64,11.2 2.01,11.2 3.01,12.2 U1.13
  Top 0.203: C7-15.C 32.59,2.53 C8-15.A
  Top 0.254: v42.2,3.2 41.53,3.87 C4-14.A | v47.7,3 47.5,3 C2-14.A | v44.7,3.2 44.03,3.87 C3-14.A | C7-9.C 33.07,17.43 33.07,15.13 C7-10.C 33.07,14.93 33.07,12.63 C7-11.C C7-12.C C7-13.C C7-14.C 32.97,4.02 33.51,3.48 33.51,3.07 C7-15.C 31.87,2.53 v31.7,2.7 | v39.7,3.2 39.03,3.87 C5-14.A | v37.3,3.3 37.2,3.3 C6-14.A
  Bottom 0.178: 5.65,10.5 2.34,10.5 v1.64,11.2
  Bottom 0.203: 28.81,2.75 27.92,1.86 9.51,1.86 7.54,3.83 7.54,8.61 5.65,10.5 | 32.12,2.37 35.8,2.37 36.73,3.3
  Bottom 0.254: v47.7,3 44.9,3 v44.7,3.2 v42.2,3.2 v39.7,3.2 37.4,3.2 v37.3,3.3 36.73,3.3 | 28.81,2.75 31.7,2.75 v31.7,2.7 31.79,2.7 32.12,2.37
CB8  (via drill 0.39)
  Top 0.178: U1.14 3.4,11.8 v1.68,10.09
  Top 0.254: C8-9.C C8-10.C C8-11.C C8-12.C C8-13.C C8-14.C C8-15.C 30.5,2.5 v30.5,1 | C7-15.A 35.13,1.47 v35.5,1.1 | C6-15.A 37.63,1.47 v38.1,1 | C5-15.A 40.03,1.47 v40.6,0.9 | C4-15.A 42.63,1.47 v43.2,0.9 | C3-15.A 44.93,1.47 v45.6,0.8 45.86,0.8 C2-15.A
  Bottom 0.203: v30.5,1 30.14,1.36 | 30.14,1.36 9.41,1.36 6.93,3.83 6.93,8.04 4.88,10.09 v1.68,10.09 | 30.14,1.36 34.02,1.36 34.28,1.1 v35.5,1.1
  Bottom 0.254: v45.6,0.8 45.5,0.9 v43.2,0.9 v40.6,0.9 40.5,1 v38.1,1 35.6,1 v35.5,1.1
DISPLAY_POWER
  Top 0.178: 5.75,20.85 5.15,20.85 3.2,18.9 1.38,18.9 0.68,18.2 0.68,8.55 1.73,7.5 3.05,7.5 3.7,6.85 J2.2 | 5.75,20.85 6.75,20.85 | 6.75,20.85 7.85,20.85 8.7,20 8.7,17.5 7.89,16.69 C7.1 C2.1 C3.1 5.8,16.54 6.3,16.04 U1.2 | R3.1 5.74,20.84 5.75,20.85 | R4.2 6.76,20.86 6.75,20.85
GND  (via drill 0.39)
  Top 0.178: v5.07,13.1 5.05,13.12 5.1,13.16 U1.5
  other vias: 4.17,17.8 7.88,19.2 2.02,8.96 1.01,6.96
  pour Top: -0.3,23.36 -0.3,-0.3 9.11,-0.3 9.11,23.36
  pour Bottom: -0.1,23.16 -0.1,-0.1 8.94,-0.1 8.94,23.16
N$1
  Top 0.178: U1.3 5.9,15.79 5.33,16.35 5.33,18.08 6.76,19.51 R3.2
N$2
  Top 0.178: U1.16 4.7,10.04 4.26,9.6 C1.1
N$3  (via drill 0.35)
  Top 0.178: U1.4 5.5,15.75 4.75,16.5 v4.75,18.75 | v4.75,21.75 R4.1
  Bottom 0.178: v4.75,18.75 v4.75,21.75
R_EXT
  Top 0.178: R2.1 3.5,17.5 4.35,16.65 4.35,16.15 4.7,15.8 U1.6
SCL
  Top 0.178: U1.20 6.3,8.45 5.7,7.85 J2.4
SDA
  Top 0.178: U1.19 5.9,8.9 4.7,7.7 J2.3

### Text on the board
tPlace: LED Board v2.0
bPlace: LED Board | Designed by Akram Ali / v2.0 | 2023-12-04 | I2C addr: 0x74